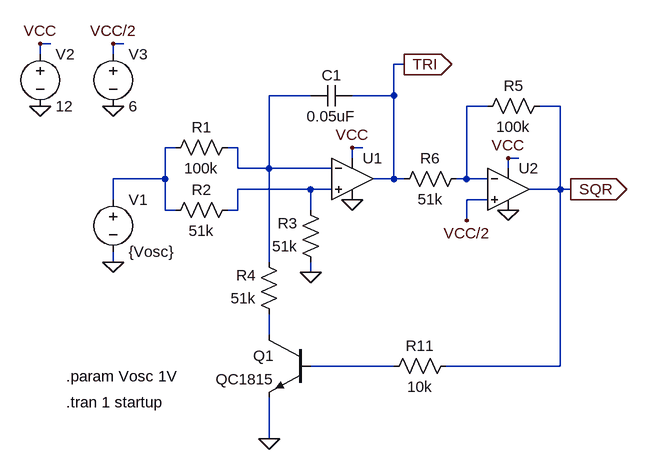
[diagram p0: schematic VCO_Tri_Sqr_JRC.asc]
VCO_Tri_Sqr_JRC.asc, the LTspice schematic file:
Version 4
SHEET 1 1064 680
WIRE -80 -96 -96 -96
WIRE 32 -96 16 -96
WIRE -96 -80 -96 -96
WIRE 16 -80 16 -96
WIRE 464 -64 448 -64
WIRE 320 -16 256 -16
WIRE 448 -16 448 -64
WIRE 448 -16 384 -16
WIRE 592 0 560 0
WIRE 704 0 672 0
WIRE 112 64 96 64
WIRE 208 64 192 64
WIRE 400 64 384 64
WIRE 384 80 384 64
WIRE 640 80 624 80
WIRE 208 96 208 64
WIRE 256 96 256 -16
WIRE 256 96 208 96
WIRE 352 96 256 96
WIRE 624 96 624 80
WIRE 96 112 96 64
WIRE 96 112 16 112
WIRE 448 112 448 -16
WIRE 448 112 416 112
WIRE 464 112 448 112
WIRE 560 112 560 0
WIRE 560 112 544 112
WIRE 592 112 560 112
WIRE 320 128 208 128
WIRE 352 128 320 128
WIRE 704 128 704 0
WIRE 704 128 656 128
WIRE 720 128 704 128
WIRE 16 144 16 112
WIRE 592 144 560 144
WIRE 96 160 96 112
WIRE 112 160 96 160
WIRE 208 160 208 128
WIRE 208 160 192 160
WIRE 320 160 320 128
WIRE 560 176 560 144
WIRE 16 240 16 224
WIRE 256 240 256 96
WIRE 320 256 320 240
WIRE 256 352 256 320
WIRE 448 400 320 400
WIRE 704 400 704 128
WIRE 704 400 528 400
WIRE 256 512 256 448
FLAG 384 64 VCC
FLAG 384 144 0
FLAG 256 512 0
FLAG 320 256 0
FLAG 624 160 0
FLAG 624 80 VCC
FLAG 16 240 0
FLAG -96 0 0
FLAG -96 -96 VCC
FLAG 720 128 SQR
IOPIN 720 128 Out
FLAG 464 -64 TRI
IOPIN 464 -64 Out
FLAG 560 176 VCC/2
FLAG 16 0 0
FLAG 16 -96 VCC/2
SYMBOL Opamps\\UniversalOpamp2 384 112 R0
SYMATTR InstName U1
SYMBOL voltage 16 128 R0
WINDOW 123 0 0 Left 2
WINDOW 39 0 0 Left 2
SYMATTR InstName V1
SYMATTR Value {Vosc}
SYMBOL res 208 48 R90
WINDOW 0 0 56 VBottom 2
WINDOW 3 32 56 VTop 2
SYMATTR InstName R1
SYMATTR Value 100k
SYMBOL res 208 144 R90
WINDOW 0 0 56 VBottom 2
WINDOW 3 32 56 VTop 2
SYMATTR InstName R2
SYMATTR Value 51k
SYMBOL res 336 256 R180
WINDOW 0 36 76 Left 2
WINDOW 3 36 40 Left 2
SYMATTR InstName R3
SYMATTR Value 51k
SYMBOL res 272 336 R180
WINDOW 0 36 76 Left 2
WINDOW 3 36 40 Left 2
SYMATTR InstName R4
SYMATTR Value 51k
SYMBOL cap 384 -32 R90
WINDOW 0 0 32 VBottom 2
WINDOW 3 32 32 VTop 2
SYMATTR InstName C1
SYMATTR Value 0.05uF
SYMBOL npn 320 352 M0
SYMATTR InstName Q1
SYMATTR Value QC1815
SYMBOL Opamps\\UniversalOpamp2 624 128 R0
SYMATTR InstName U2
SYMBOL res 560 96 R90
WINDOW 0 0 56 VBottom 2
WINDOW 3 32 56 VTop 2
SYMATTR InstName R6
SYMATTR Value 51k
SYMBOL res 544 384 R90
WINDOW 0 0 56 VBottom 2
WINDOW 3 32 56 VTop 2
SYMATTR InstName R11
SYMATTR Value 10k
SYMBOL voltage -96 -96 R0
WINDOW 123 0 0 Left 2
WINDOW 39 0 0 Left 2
SYMATTR InstName V2
SYMATTR Value 12
SYMBOL res 688 -16 R90
WINDOW 0 0 56 VBottom 2
WINDOW 3 32 56 VTop 2
SYMATTR InstName R5
SYMATTR Value 100k
SYMBOL voltage 16 -96 R0
WINDOW 123 0 0 Left 2
WINDOW 39 0 0 Left 2
SYMATTR InstName V3
SYMATTR Value 6
TEXT -56 416 Left 2 !.param Vosc 1V
TEXT -56 456 Left 2 !.tran 1 startup

The netlist it stands for:
* VCO_Tri_Sqr_JRC.asc
XU1 N004 N001 VCC 0 TRI level.2 Avol=1Meg GBW=10Meg Slew=10Meg ilimit=25m rail=0 Vos=0 phimargin=45 en=0 enk=0 in=0 ink=0 Rin=500Meg  ; pins IN+ IN- V+ V- OUT
V1 N003 0 {Vosc}
R1 N001 N003 100k
R2 N004 N003 51k
R3 0 N004 51k
R4 N005 N001 51k
C1 TRI N001 0.05uF
Q1 N005 N006 0 0 QC1815
XU2 VCC/2 N002 VCC 0 SQR level.2 Avol=1Meg GBW=10Meg Slew=10Meg ilimit=25m rail=0 Vos=0 phimargin=45 en=0 enk=0 in=0 ink=0 Rin=500Meg  ; pins IN+ IN- V+ V- OUT
R6 N002 TRI 51k
R11 SQR N006 10k
V2 VCC 0 12
R5 SQR N002 100k
V3 VCC/2 0 6
.model NPN NPN
.model PNP PNP
.lib standard.bjt
.param Vosc 1V
.tran 1 startup
.lib UniversalOpamps2.sub
.backanno
.end